# Altium schematic sheet WL-BPF.SchDoc
size 594 x 420 mm; Address1: Address1; Address2: Address2; Address3: Address3; Address4: Address4; DocumentNumber: Wolf-Lite; SheetNumber: 10; Scale: 1:1; DocumentType: Схема электрическая принципиальная; FirstReferrence: UA3REO/R7KBI; ListNumber: 2
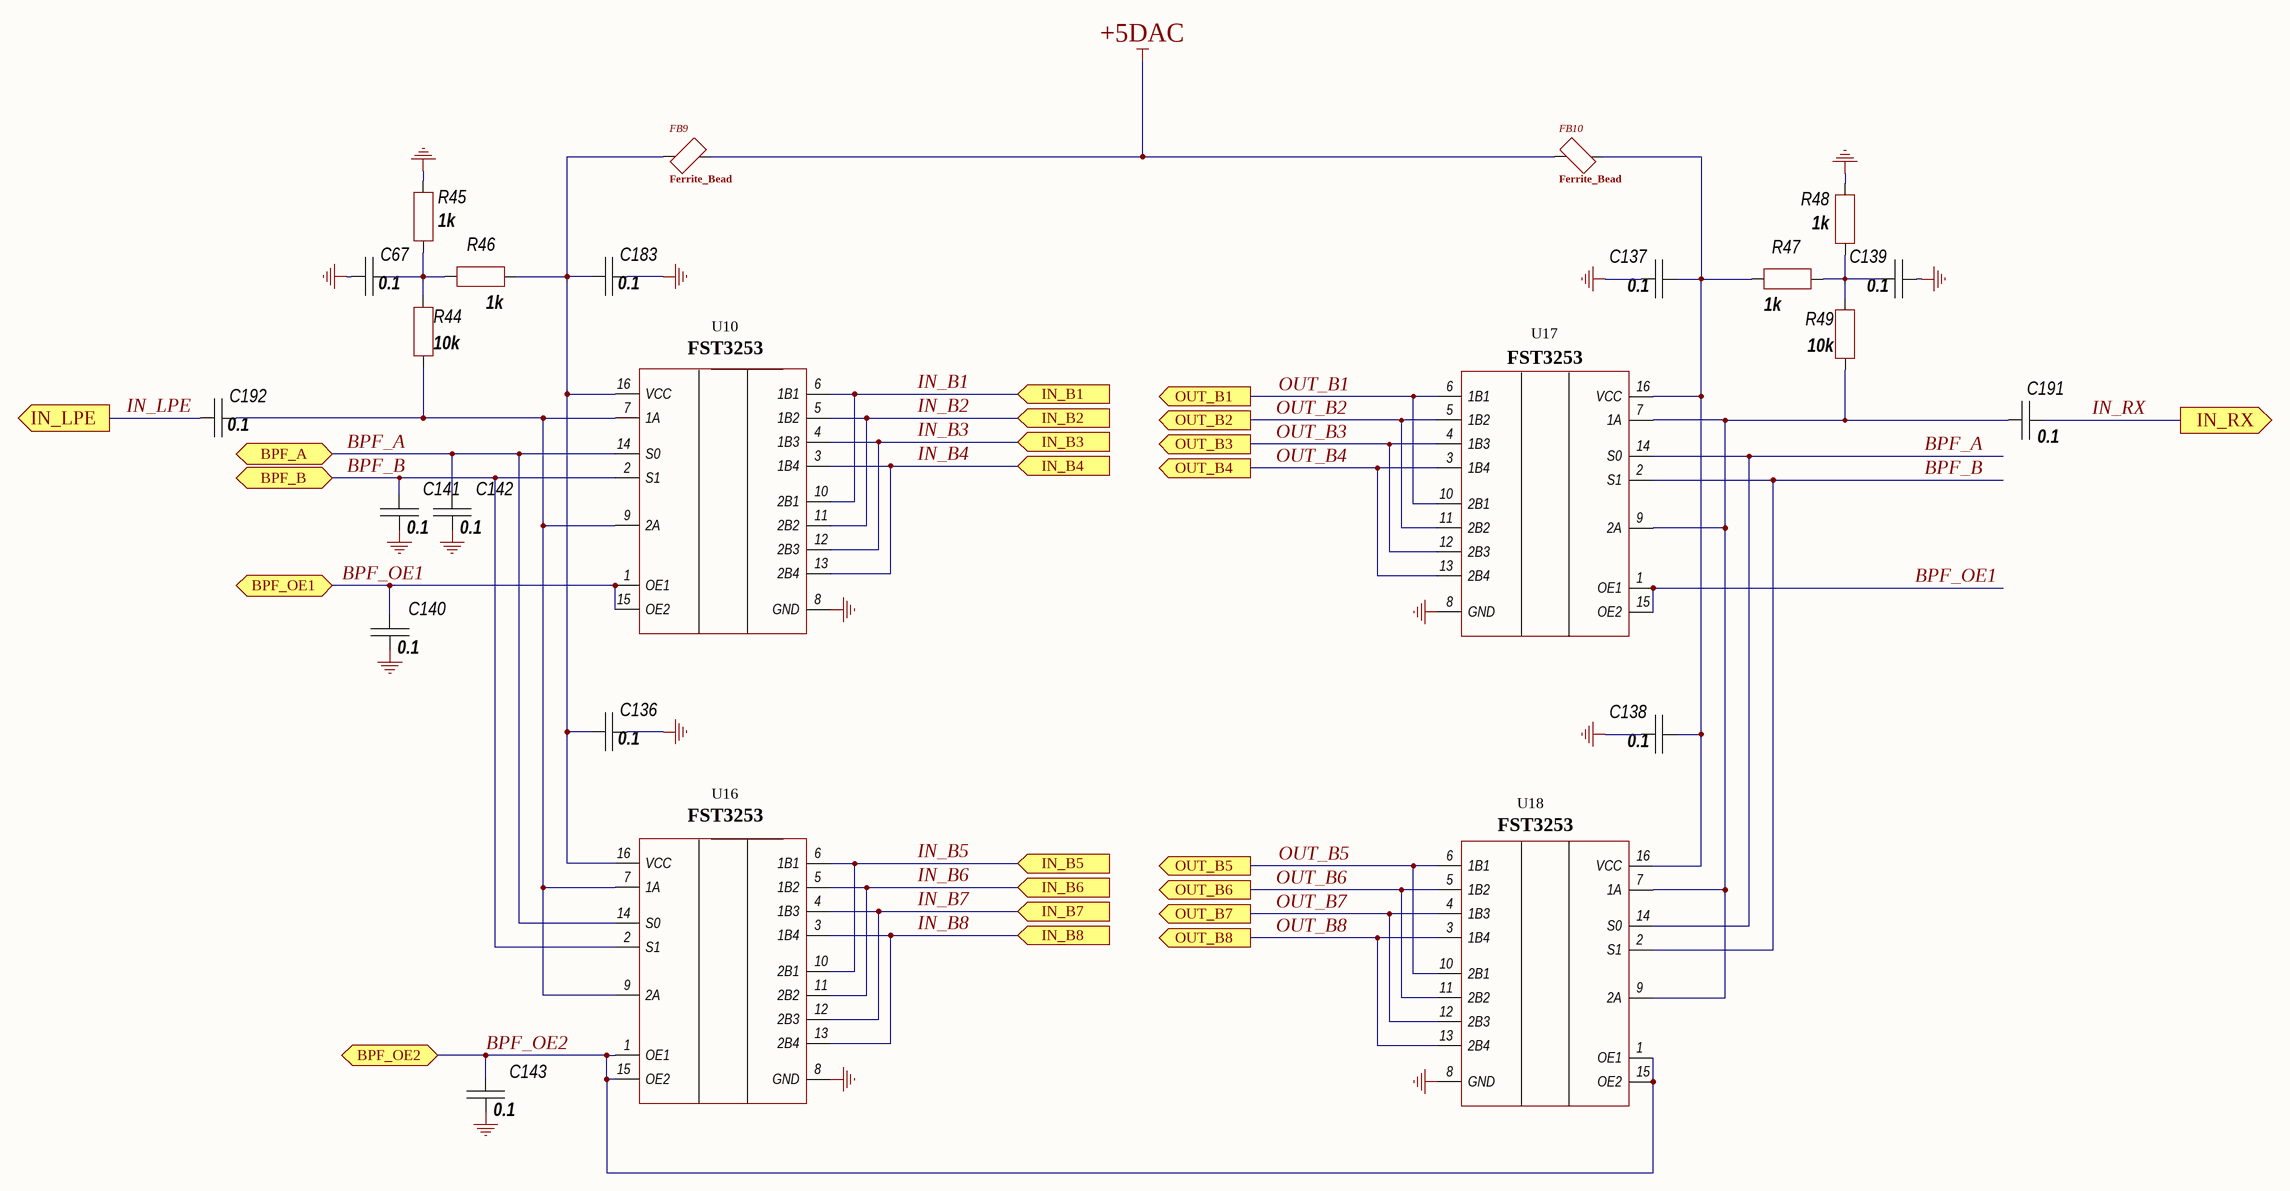
[diagram p0: WL-BPF.SchDoc]

## Parts
C67  0.1  [CH0805C]
C136  0.1  [CH0805C]
C137  0.1  [CH0805C]
C138  0.1  [CH0805C]
C139  0.1  [CH0805C]
C140  0.1  [CH0805C]
C141  0.1  [CH0805C]
C142  0.1  [CH0805C]
C143  0.1  [CH0805C]
C183  0.1  [CH0805C]
C191  0.1  [CH0805C]
C192  0.1  [CH0805C]
FB9  Ferrite_Bead  [CH0805L]
FB10  Ferrite_Bead  [CH0805L]
R44  10k  [CH0805R]
R45  1k  [CH0805R]
R46  1k  [CH0805R]
R47  1k  [CH0805R]
R48  1k  [CH0805R]
R49  10k  [CH0805R]
U10  FST3253  [16-SSOP]
U16  FST3253  [16-SSOP]
U17  FST3253  [16-SSOP]
U18  FST3253  [16-SSOP]

## Ports
BPF_A (bidir), BPF_B (bidir), BPF_OE1 (bidir), BPF_OE2 (bidir), IN_B1 (in), IN_B2 (in), IN_B3 (in), IN_B4 (in), IN_B5 (in), IN_B6 (in), IN_B7 (in), IN_B8 (in), IN_LPE (out), IN_RX (out), OUT_B1 (out), OUT_B2 (out), OUT_B3 (out), OUT_B4 (out), OUT_B5 (out), OUT_B6 (out), OUT_B7 (out), OUT_B8 (out)

## Nets
+5DAC: FB9.2 FB10.2
GND: C67.1 C136.2 C137.2 C138.2 C139.1 C140.2 C141.2 C142.2 C143.2 C183.2 R45.1 R48.1 U10.8(GND) U16.8(GND) U17.8(GND) U18.8(GND)
BPF_A: C142.1 U10.14(S0) U16.14(S0) U17.14(S0) U18.14(S0) ; port BPF_A
BPF_B: C141.1 U10.2(S1) U16.2(S1) U17.2(S1) U18.2(S1) ; port BPF_B
BPF_OE1: C140.1 U10.1(OE1) U10.15(OE2) U17.1(OE1) U17.15(OE2) ; port BPF_OE1
BPF_OE2: C143.1 U16.1(OE1) U16.15(OE2) U18.1(OE1) U18.15(OE2) ; port BPF_OE2
IN_B1: U10.6(1B1) U10.10(2B1) ; port IN_B1
IN_B2: U10.5(1B2) U10.11(2B2) ; port IN_B2
IN_B3: U10.4(1B3) U10.12(2B3) ; port IN_B3
IN_B4: U10.3(1B4) U10.13(2B4) ; port IN_B4
IN_B5: U16.6(1B1) U16.10(2B1) ; port IN_B5
IN_B6: U16.5(1B2) U16.11(2B2) ; port IN_B6
IN_B7: U16.4(1B3) U16.12(2B3) ; port IN_B7
IN_B8: U16.3(1B4) U16.13(2B4) ; port IN_B8
IN_LPE: C192.1 ; port IN_LPE
IN_RX: C191.1 ; port IN_RX
OUT_B1: U17.6(1B1) U17.10(2B1) ; port OUT_B1
OUT_B2: U17.5(1B2) U17.11(2B2) ; port OUT_B2
OUT_B3: U17.4(1B3) U17.12(2B3) ; port OUT_B3
OUT_B4: U17.3(1B4) U17.13(2B4) ; port OUT_B4
OUT_B5: U18.6(1B1) U18.10(2B1) ; port OUT_B5
OUT_B6: U18.5(1B2) U18.11(2B2) ; port OUT_B6
OUT_B7: U18.4(1B3) U18.12(2B3) ; port OUT_B7
OUT_B8: U18.3(1B4) U18.13(2B4) ; port OUT_B8
NetC67_2: C67.2 R44.2 R45.2 R46.2
NetC136_1: C136.1 C183.1 FB9.1 R46.1 U10.16(VCC) U16.16(VCC)
NetC137_1: C137.1 C138.1 FB10.1 R47.1 U17.16(VCC) U18.16(VCC)
NetC139_2: C139.2 R47.2 R48.2 R49.2
NetC191_2: C191.2 R49.1 U17.7(1A) U17.9(2A) U18.7(1A) U18.9(2A)
NetC192_2: C192.2 R44.1 U10.7(1A) U10.9(2A) U16.7(1A) U16.9(2A)

## Notes on the sheet
- Перв. примен.
- Справ. №
- Подп. и дата
- Инв. № дубл.
- Взам. инв. №
- Инв. № подл.
- Изм.
- Лист
- № докум.
- Подп.
- Дата
- 2.106-A2
- Копировал
- Формат А2

## Library data of the parts
C67 C136-C143 C183 C191 C192 = Capacitor: Manufacturer: *; Model: *; HelpURL: *; ComponentKind: *; Value: *
FB9 FB10 = FB
R44-R49 = Resistor: Manufacturer: *; Model: *; HelpURL: *; ComponentKind: *; Value: *